# Altium schematic sheet MicroSD_Card.SchDoc
size A4; Organization: Altium Limited; Address1: L3, 12a Rodborough Rd; Address2: Frenchs Forest; Address3: NSW; Address4: Australia 2086; SheetNumber: 6; SheetTotal: 7
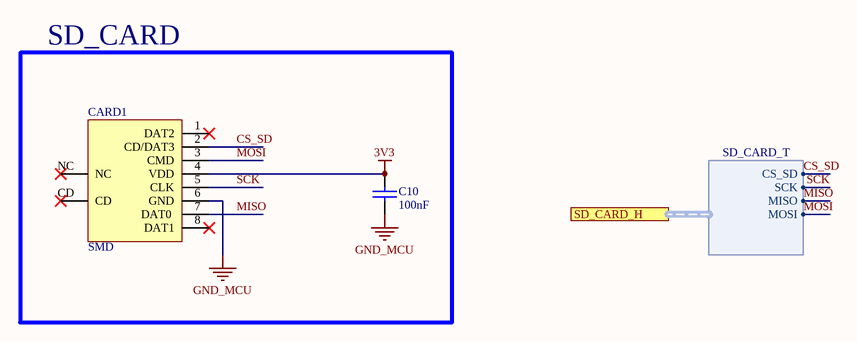
[diagram p0: MicroSD_Card.SchDoc]

## Parts
C10  value 100nF  [0603_cap]  (hidden comment: CAP CER 100nF 50V X7R 0603)
CARD1  SMD  [SD_CARD_PUSH_PCB]

## Blocks framed on the sheet
SD_CARD: C10 CARD1

## Ports
SD_CARD_H (harness SD_CARD_T, see Main[2C], Micro[3C])

## Harnesses
SD_CARD_T: SCK, MISO, MOSI, CS_SD

## Nets
3V3: C10.1 CARD1.4(VDD)
GND_MCU: C10.2 CARD1.6(GND)
CS_SD: CARD1.2(CD/DAT3) ; port SD_CARD_H.CS_SD
MISO: CARD1.7(DAT0) ; port SD_CARD_H.MISO
MOSI: CARD1.3(CMD) ; port SD_CARD_H.MOSI
SCK: CARD1.5(CLK) ; port SD_CARD_H.SCK

Not connected (* = marked no-connect by the designer): CARD1 1(DAT2)* 8(DAT1)* CD* NC*

## Notes on the sheet
- Title
- Size:
- Date:
- A4
- Number:
- Time:
- Revision:
- Sheet
- of
- File:

## Library data of the parts
C10 = Cap_100nF_0603_50V: 50V 100nF X7R ±10% 0603 Ceramic Capacitors RoHS; Manufacturer: FOJAN; Manufacturer Part Number: FCC0603B104K500CT; Supplier 1: LCSC; Supplier Part Number 1: C5137636; ComponentLink1Description: LCSC; ComponentLink1URL: https://www.lcsc.com/product-detail/C5137636.html
CARD1 = SD_CARD_PUSH: Push-Push 2mm Connector and Ejector MicroSD Card (TF Card) SMD PC Card Sockets RoHS; Manufacturer: Yuandi; Manufacturer Part Number: TF-01A; Supplier 1: LCSC; Supplier Part Number 1: C2889258; ComponentLink1Description: LCSC; ComponentLink1URL: https://www.lcsc.com/product-detail/C2889258.html?s_z=n_TF-01A_C2889258